# Altium schematic sheet Supplies.SchDoc
size 431 x 279 mm; Organization: ORGANIZATION; Address1: ADDRESS 1; Address2: ADDRESS 2; Address3: ADDRESS 3; Address4: ADDRESS 4; Revision: -; SheetNumber: 6; SheetTotal: 7; ENG_APP_DATE: --/--/--; DSN_APP_DATE: --/--/--; CHK_APP_DATE: --/--/--; SPICEModelCacheRLJPMQWR: <root> / <DocumentId>RLJPMQWR</DocumentId> / <CacheFrame Number="0"> / <Model Name="limit" Kind="CKT"> / <Text>*$ / .subckt limit d dc params: clampH=0.99 clampL=48m / Gd 0 dcx VALUE = { V(d)*100u } / Rdc dcx 0 10k / V1 clpn 0 {clampL} / V2 clpp 0 {clampH} / D1 clpn dcx dclamp / D2 dcx clpp dclamp / Edc dc 0 value={ V(dcx) } / .model dclamp d n=0.01 rs=100m / .ENDS</Text> / </Model> / <Model Name="limit2" Kind="CKT"> / <Text>*$ / .subckt limit2 d2nc d d2c / Gd 0 d2cx d2nc 0 100u / Rdc d2cx 0 10k / V1 clpn 0 7m / E2 clpp 0 Value = { 1-V(d) } / D1 clpn d2cx dclamp / D2 d2cx clpp dclamp / Edc d2c 0 value={ V(d2cx) } / .model dclamp d n=0.01 rs=100m / .ENDS</Text> / </Model> / <Model Name="varicap" Kind="CKT"> / <Text>*$ / .SUBCKT VARICAP 1 2 CTRL / GCAP 1 2 VALUE= {V(CTRL)*(DDT(V(1) - V(2)))} / .ENDS</Text> / </Model> / <Model Name="ccm3" Kind="CKT"> / <Text>*$ / .SUBCKT CCM3 a c p vc dc params: L=4.7u Fs=500k Ri=100m Acs=1 SE=0 / E_RI_mult RI_mult 0 Value = {ABS({-0.0895*V(a)+1.4416})} / E_se Se1 0 value = {ABS(I(VM))} / R111 se1 Se2 15.9 / C11 Se2 0 1u / E_SE_mult SE_mult 0 Value = {ABS({1.0526*V(SE2)+14.895})} / ESe Sa 0 value = { SE*FS*Ri*V(RI_mult)*V(SE_mult)} / Edc dcx 0 value = { v(cx,p)/(v(a,p)+1u) } / Xdc dcx dc limit params: clampH=0.99 clampL=48m / Ed2 d2X 0 value = {(1 - V(dc))} / Xd2 d2X dc d2 limit2 / GIap a p value =  {V(dc)*I(VM)} / GIpc p cx value = { V(vc)/({Acs}*{Ri*V(RI_mult) }) } / GImju cx p value = {V(Sa)*V(dc)/({Acs}*{Ri*V(RI_mult)}*{Fs})+(v(cx,p))/({L}*{Fs})*((1-(V(dc))/2)) } / XC1 cx p mode varicap / Emode mode 0 Value = { IF ((2*{L}*{Fs}*I(VM)/(V(dc)*V(a,cx)+1u)) / + &lt; 1, {4/({L}*(6.28*{Fs})^2)}, {4/({L}*(6.28*{Fs})^2)}) } / VM cx c / .ENDS CCM3</Text> / <Dependency>0\limit</Dependency> / <Dependency>0\limit2</Dependency> / <Dependency>0\varicap</Dependency> / </Model> / <Model Name="ccm2" Kind="CKT"> / <Text>*$ / .SUBCKT CCM2 a c p vc dc params: L=4.7u Fs=500k Ri=100m Acs=1 SE=0 / E_RI_mult RI_mult 0 Value = {ABS({-0.1*V(a)+1.35})} / E_se Se1 0 value = {ABS(I(VM))} / R111 se1 Se2 15.9 / C11 Se2 0 1u / E_SE_mult SE_mult 0 Value = {ABS({2.3492*V(SE2)+11.265})} / ESe Sa 0 value = { SE*FS*Ri*V(RI_mult)*V(SE_mult)} / Edc dcx 0 value = { v(cx,p)/(v(a,p)+1u) } / Xdc dcx dc limit params: clampH=0.99 clampL=48m / Ed2 d2X 0 value = {(1 - V(dc))} / Xd2 d2X dc d2 limit2 / GIap a p value =  {V(dc)*I(VM)} / GIpc p cx value = { V(vc)/({Acs}*{Ri*V(RI_mult) }) } / GImju cx p value = {V(Sa)*V(dc)/({Acs}*{Ri*V(RI_mult)}*{Fs})+(v(cx,p))/({L}*{Fs})*((1-(V(dc))/2)) } / XC1 cx p mode varicap / Emode mode 0 Value = { IF ((2*{L}*{Fs}*I(VM)/(V(dc)*V(a,cx)+1u)) / + &lt; 1, {4/({L}*(6.28*{Fs})^2)}, {4/({L}*(6.28*{Fs})^2)}) } / VM cx c / .ENDS CCM2</Text> / <Dependency>0\limit</Dependency> / <Dependency>0\limit2</Dependency> / <Dependency>0\varicap</Dependency> / </Model> / <Model Name="ccm1" Kind="CKT"> / <Text>*$ / .SUBCKT CCM1 a c p vc dc params: L=4.7u Fs=500k Ri=100m Acs=1 SE=0 / E_RI_mult RI_mult 0 Value = {ABS({-0.0411*V(a)+1.0268})} / E_se Se1 0 value = {ABS(I(VM))} / R111 se1 Se2 15.9 / C11 Se2 0 1u / E_SE_mult SE_mult 0 Value = {ABS({4.2153*V(SE2)+6.5785})} / ESe Sa 0 value = { SE*FS*Ri*V(RI_mult)*V(SE_mult)} / Edc dcx 0 value = { v(cx,p)/(v(a,p)+1u) } / Xdc dcx dc limit params: clampH=0.99 clampL=48m / Ed2 d2X 0 value = {(1 - V(dc))} / Xd2 d2X dc d2 limit2 / GIap a p value =  {V(dc)*I(VM)} / GIpc p cx value = { V(vc)/({Acs}*{Ri*V(RI_mult) }) } / GImju cx p value = {V(Sa)*V(dc)/({Acs}*{Ri*V(RI_mult)}*{Fs})+(v(cx,p))/({L}*{Fs})*((1-(V(dc))/2)) } / XC1 cx p mode varicap / Emode mode 0 Value = { IF ((2*{L}*{Fs}*I(VM)/(V(dc)*V(a,cx)+1u)) / + &lt; 1, {4/({L}*(6.28*{Fs})^2)}, {4/({L}*(6.28*{Fs})^2)}) } / VM cx c 0 / .ENDS CCM1</Text> / <Dependency>0\limit</Dependency> / <Dependency>0\limit2</Dependency> / <Dependency>0\varicap</Dependency> / </Model> / <Model Name="tps65266_avg" Kind="CKT"> / <Text>*$ / * TPS65266 / ***************************************************************************** / * (C) Copyright 2014 Texas Instruments Incorporated. All rights reserved. / ***************************************************************************** / ** This model is designed as an aid for customers of Texas Instruments. / ** TI and its licensors and suppliers make no warranties, either expressed / ** or implied, with respect to this model, including the warranties of / ** merchantability or fitness for a particular purpose.  The model is / ** provided solely on an "as is" basis.  The entire risk as to its quality / ** and performance is with the customer / ***************************************************************************** / * / * This model is subject to change without notice. Texas Instruments / * Incorporated is not responsible for updating this model. / * / ***************************************************************************** / * / ** Released by: WEBENCH Design Center, Texas Instruments Inc. / * Part: TPS65266 / * Date: 25NOV2014 / * Model Type: AVERAGE / * Simulator: PSPICE / * Simulator Version: 16.2.0.p001 / * EVM Order Number: TPS65266EVM-686 / * EVM Users Guide: NA / * Datasheet: NA / * / * Model Version: Final 1.00 / * / ***************************************************************************** / * / * Updates: / * / * Final 1.00 / * Release to Web. / * / ***************************************************************************** / .SUBCKT TPS65266_AVG COMP1 COMP2 COMP3 FB1 FB2 FB3 LX1 LX2 LX3 VIN1 VIN2 VIN3 / + VINQ EN1 EN2 EN3 SS1 SS2 SS3 ROSC BST1 BST2 BST3 PGOOD AGND_0 AGND_1 AGND_2 AGND_3 AGND_4 / + PGND1 PGND2 PGND3 PAD PARAMS: L1=2.2u L2=2.2u L3=2.2u FS1=1000k FS2=1000k FS3=1000k / RVINQ1 VINQ PGND1 1e8 / RVINQ2 VINQ PGND1 1e8 / REN1 EN1 PGND1 1e8 / REN2 EN1 PGND1 1e8 / REN3 EN2 PGND1 1e8 / REN4 EN2 PGND1 1e8 / REN5 EN3 PGND1 1e8 / REN6 EN3 PGND1 1e8 / RSS1 SS1 PGND1 1e8 / RSS2 SS1 PGND1 1e8 / RSS3 SS2 PGND1 1e8 / RSS4 SS2 PGND1 1e8 / RSS5 SS3 PGND1 1e8 / RSS6 SS3 PGND1 1e8 / R_ROSC1 ROSC PGND1 1e8 / R_ROSC2 ROSC PGND1 1e8 / RBST1 BST1 PGND1 1e8 / RBST2 BST1 PGND1 1e8 / RBST3 BST2 PGND1 1e8 / RBST4 BST2 PGND1 1e8 / RBST5 BST3 PGND1 1e8 / RBST6 BST3 PGND1 1e8 / R_PGOOD1 PGOOD PGND1 1e8 / R_PGOOD2 PGOOD PGND1 1e8 / R1 0 AGND_0 1u / R2 0 AGND_1 1u / R3 0 AGND_2 1u / R4 0 AGND_3 1u / R5 0 AGND_4 1u / R5x AGND_4 0 1u / R6 0 PGND_2 1u / R61 0 PGND_2 1u / R7 0 PGND_3 1u / R71 0 PGND_3 1u / RPAD1 PAD 0 1e8 / RPAD2 PAD 0 1e8 / G_U2_ABM2I1         COMP2 0 VALUE { (V(FB2) - V(VREF_INT))* / + {0.1658*I(V_U2_V1)+0.6284}*300u    } / V_U2_V1         U2_N14535319 LX2 0Vdc / R_U2_R19         0 COMP2  13.3e6 / X_U2_U5         VIN2 U2_N14535319 0 COMP2 U2_DC CCM2 PARAMS:  L={L2} FS={FS2} / +  RI={100m} SE={275k/FS2} ACS=1 / X_U3_U5         VIN3 U3_N14535845 0 COMP3 U3_DC CCM3 PARAMS:  L={L3} FS={FS3} / +  RI={100m} SE={275k/FS3} ACS=1 / G_U3_ABM2I1         COMP3 0 VALUE { (V(FB3) - V(VREF_INT))* / + {0.0526*I(V_U3_V1)+0.8947}*300u    } / V_U3_V1         U3_N14535845 LX3 0Vdc / R_U3_R19         0 COMP3  13.3e6 / R_R1         0 PGND1  1m / V_V29         VREF_INT PGND1 0.6 / G_U1_ABM2I1         COMP1 0 VALUE { (V(FB1) - V(VREF_INT))* / + {0.0983*I(V_U1_V1)+0.7052}*300u    } / R_U1_R19         0 COMP1  13.3e6 / V_U1_V1         U1_N14534791 LX1 0Vdc / X_U1_U5         VIN1 U1_N14534791 0 COMP1 U1_DC CCM1 PARAMS:  L={L1} FS={FS1} / +  RI={100m} SE={275k/FS1} ACS=1 / .ENDS TPS65266_AVG</Text> / <Dependency>0\ccm3</Dependency> / <Dependency>0\ccm2</Dependency> / <Dependency>0\ccm1</Dependency> / </Model> / <Model Name="grm21br61a226me44" Kind="CKT"> / <Text>*---------------------------------------------------------------------- / * SPICE Model generated by Murata Manufacturing Co., Ltd. / * Copyright(C) Murata Manufacturing Co., Ltd. / * Description :2012M(0805)/X5R/22uF/10V / * Murata P/N :GRM21BR61A226ME44 / * Property : C = 22[uF] / * Data Generated on Jan 8, 2019 / *---------------------------------------------------------------------- / * Applicable Conditions: / *   Frequency Range = 100Hz-6GHz / *   Temperature = 25 degC / *   DC Bias Voltage = 0V / *   Small Signal Operation / *---------------------------------------------------------------------- / .SUBCKT GRM21BR61A226ME44 port1 port2 / C1 port1 11 1.70e-5 / L2 11 12 1.60e-10 / R3 12 13 2.11e-3 / C4 13 14 6.67e-4 / R4 13 14 7.95 / C5 14 15 7.65e-4 / R5 14 15 7.74e-1 / C6 15 16 7.03e-4 / R6 15 16 9.99e-2 / C7 16 17 6.45e-4 / R7 16 17 1.24e-2 / C8 17 18 6.19e-4 / R8 17 18 1.97e-3 / L9 18 19 1.62e-11 / R9 18 19 5.44e-2 / L10 19 20 3.66e-11 / R10 19 20 2.02e-2 / L11 20 21 3.37e-10 / R11 20 21 1.34e-2 / C12 21 22 5.83e-5 / L12 21 22 6.41e-11 / R12 21 22 3.35e-3 / C13 22 23 2.26e-5 / L13 22 23 8.31e-11 / R13 22 23 3.61e-3 / C14 23 port2 4.77e-12 / L14 23 port2 8.46e-11 / R14 23 port2 14.7 / R100 port1 11 2.27e+6 / .ENDS GRM21BR61A226ME44</Text> / </Model> / <Model Name="grm033r71c472ke14" Kind="CKT"> / <Text>*---------------------------------------------------------------------- / * SPICE Model generated by Murata Manufacturing Co., Ltd. / * Copyright(C) Murata Manufacturing Co., Ltd. / * Description :0603M(0201)/X7R/4700pF/16V / * Murata P/N :GRM033R71C472KE14 / * Property : C = 4700[pF] / * Data Generated on Nov 6, 2018 / *---------------------------------------------------------------------- / * Applicable Conditions: / *   Frequency Range = 100Hz-6GHz / *   Temperature = 25 degC / *   DC Bias Voltage = 0V / *   Small Signal Operation / *---------------------------------------------------------------------- / .SUBCKT GRM033R71C472KE14 port1 port2 / C1 port1 11 4.78e-9 / L2 11 12 2.10e-10 / R3 12 13 1.03e-1 / C4 13 14 4.70e-7 / R4 13 14 2.85e+3 / C5 14 15 5.61e-7 / R5 14 15 272 / C6 15 16 5.58e-7 / R6 15 16 23.7 / C7 16 17 3.68e-7 / R7 16 17 3.60 / C8 17 18 2.23e-7 / R8 17 18 6.17e-1 / C9 18 19 2.36e-7 / R9 18 19 9.83e-2 / L10 19 20 4.26e-11 / R10 19 20 2.65e-1 / C11 20 21 8.59e-9 / L11 20 21 9.53e-12 / R11 20 21 4.47e-2 / C12 21 port2 9.05e-12 / L12 21 port2 2.55e-11 / R12 21 port2 2.08 / R100 port1 11 2.00e+9 / .ENDS GRM033R71C472KE14</Text> / </Model> / <Model Name="mapi_4020_74438356022_2u2" Kind="CKT"> / <Text>******* / .subckt MAPI_4020_74438356022_2u2 1 2 / Rp 1 2 4123.86235634 / Cp 1 2 9.7152950084p / Rs 1 N3 0.029 / L1 N3 2 2.18u / .ends MAPI_4020_74438356022_2u2</Text> / </Model> / <Model Name="mapi_4020_74438356047_4u7" Kind="CKT"> / <Text>******* / .subckt MAPI_4020_74438356047_4u7 1 2 / Rp 1 2 7737.2732555125 / Cp 1 2 11.1535766864p / Rs 1 N3 0.063 / L1 N3 2 4.67u / .ends MAPI_4020_74438356047_4u7</Text> / </Model> / <Model Name="c0402c102j5gacauto" Kind="CKT"> / <Text>.SUBCKT C0402C102J5GACAUTO 1 6 / *Temp = 25??C, Bias = 0VDC, Center Frequency = 10000 Hz / *KEMET Model RLC Cerm / R1 3 4 1.21294260025024 / R2 2 5 0.910000026226044 / R3 1 6 99999997952 / L1 1 2 1.36999994682085E-11 / L2 2 3 2.60299989895962E-10 / C1 4 6 9.99999971718069E-10 / C2 5 6 5.99999986588955E-14 / .ENDS</Text> / </Model> / <Model Name="grm155r71h103ka88" Kind="CKT"> / <Text>*---------------------------------------------------------------------- / * SPICE Model generated by Murata Manufacturing Co., Ltd. / * Copyright(C) Murata Manufacturing Co., Ltd. / * Description :1005M(0402)/X7R/10000pF/50V / * Murata P/N :GRM155R71H103KA88 / * Property : C = 10000[pF] / * Data Generated on Jan 10, 2017 / *---------------------------------------------------------------------- / * Applicable Conditions: / *   Frequency Range = 100kHz-6GHz / *   Temperature = 25 degC / *   DC Bias Voltage = 0V / *   Small Signal Operation / *---------------------------------------------------------------------- / .SUBCKT GRM155R71H103KA88 port1 port2 / C1 port1 11 9.66e-9 / L2 11 12 1.81e-10 / R3 12 13 4.87e-2 / C4 13 14 8.69e-7 / R4 13 14 1.77 / C5 14 15 7.39e-7 / R5 14 15 3.60e-1 / C6 15 16 9.13e-7 / R6 15 16 6.29e-2 / C7 16 17 5.45e-7 / R7 16 17 2.36e-2 / L8 17 18 5.77e-11 / R8 17 18 2.28e-1 / C9 18 19 1.55e-7 / L9 18 19 4.43e-12 / R9 18 19 1.53e-2 / C10 19 20 9.52e-9 / L10 19 20 3.19e-11 / R10 19 20 7.37e-2 / C11 20 port2 4.31e-12 / L11 20 port2 6.52e-11 / R11 20 port2 11.1 / R100 port1 11 1.00e+10 / .ENDS GRM155R71H103KA88</Text> / </Model> / <Model Name="grm155r61c225ke11" Kind="CKT"> / <Text>*---------------------------------------------------------------------- / * SPICE Model generated by Murata Manufacturing Co., Ltd. / * Copyright(C) Murata Manufacturing Co., Ltd. / * Description :1005M(0402)/X5R/2.2uF/16V / * Murata P/N :GRM155R61C225KE11 / * Property : C = 2.2[uF] / * Data Generated on Oct 1, 2019 / *---------------------------------------------------------------------- / * Applicable Conditions: / *   Frequency Range = 100Hz-6GHz / *   Temperature = 25 degC / *   DC Bias Voltage = 0V / *   Small Signal Operation / *---------------------------------------------------------------------- / .SUBCKT GRM155R61C225KE11 port1 port2 / C1 port1 11 1.73e-6 / L2 11 12 1.79e-10 / R3 12 13 6.35e-3 / C4 13 14 6.00e-5 / R4 13 14 85.7 / C5 14 15 9.14e-5 / R5 14 15 5.82 / C6 15 16 8.03e-5 / R6 15 16 9.40e-1 / C7 16 17 7.76e-5 / R7 16 17 1.47e-1 / C8 17 18 7.79e-5 / R8 17 18 2.69e-2 / C9 18 19 4.69e-5 / R9 18 19 8.75e-3 / L10 19 20 1.90e-11 / R10 19 20 2.12e-1 / L11 20 21 3.14e-11 / R11 20 21 6.04e-2 / L12 21 22 1.38e-10 / R12 21 22 2.71e-2 / C13 22 23 6.24e-6 / L13 22 23 3.27e-11 / R13 22 23 4.67e-3 / C14 23 24 2.47e-6 / L14 23 24 3.93e-11 / R14 23 24 6.91e-3 / C15 24 port2 4.51e-11 / L15 24 port2 8.52e-12 / R15 24 port2 9.19e-1 / R100 port1 11 2.27e+7 / .ENDS GRM155R61C225KE11</Text> / </Model> / </CacheFrame> / </root>
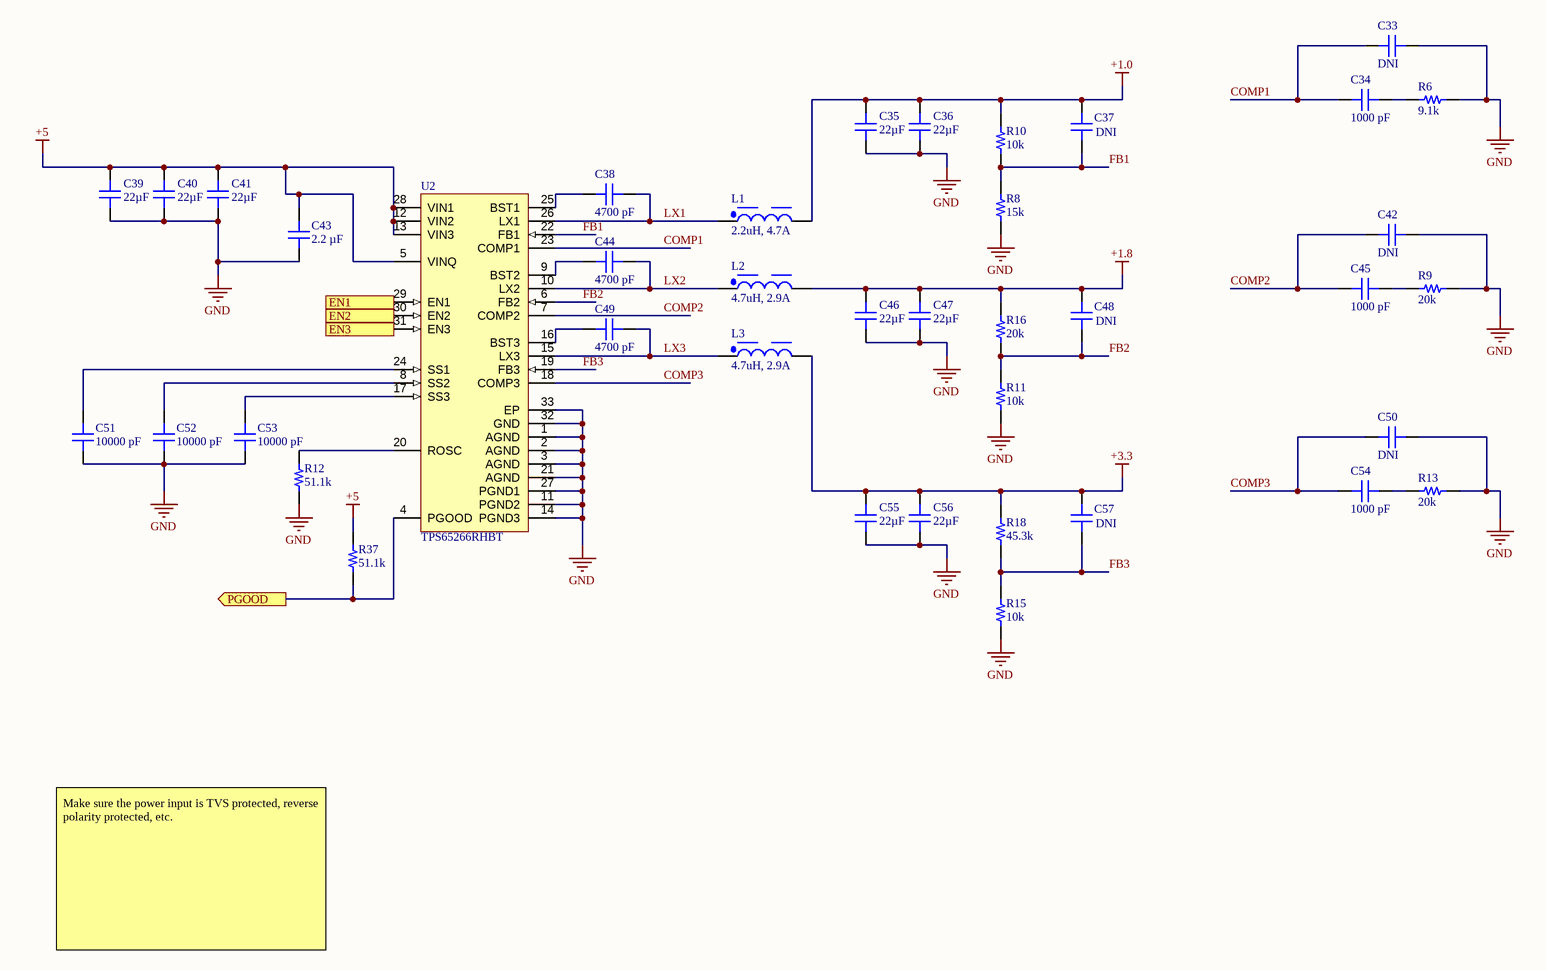
[diagram p0: Supplies.SchDoc]

## Parts
C33  DNI  [CAP 0402_1005]  (no BOM)
C34  1000 pF  [CAP 0402_1005]
C35  22µF  [CAP 0805_2012]
C36  22µF  [CAP 0805_2012]
C37  DNI  [CAP 0402_1005]  (no BOM)
C38  4700 pF  [CAP 0201_0603]
C39  22µF  [CAP 0805_2012]
C40  22µF  [CAP 0805_2012]
C41  22µF  [CAP 0805_2012]
C42  DNI  [CAP 0402_1005]  (no BOM)
C43  2.2 µF  [CAP 0402_1005]
C44  4700 pF  [CAP 0201_0603]
C45  1000 pF  [CAP 0402_1005]
C46  22µF  [CAP 0805_2012]
C47  22µF  [CAP 0805_2012]
C48  DNI  [CAP 0402_1005]  (no BOM)
C49  4700 pF  [CAP 0201_0603]
C50  DNI  [CAP 0402_1005]  (no BOM)
C51  10000 pF  [CAP 0402_1005]
C52  10000 pF  [CAP 0402_1005]
C53  10000 pF  [CAP 0402_1005]
C54  1000 pF  [CAP 0402_1005]
C55  22µF  [CAP 0805_2012]
C56  22µF  [CAP 0805_2012]
C57  DNI  [CAP 0402_1005]  (no BOM)
L1  2.2uH, 4.7A  [WE-MAPI_4020]
L2  4.7uH, 2.9A  [WE-MAPI_4020]
L3  4.7uH, 2.9A  [WE-MAPI_4020]
R6  9.1k  [RES 0402_1005]
R8  15k  [RES 0402_1005]
R9  20k  [RES 0402_1005]
R10  10k  [RES 0402_1005]
R11  10k  [RES 0402_1005]
R12  51.1k  [RES 0402_1005]
R13  20k  [RES 0402_1005]
R15  10k  [RES 0402_1005]
R16  20k  [RES 0402_1005]
R18  45.3k  [RES 0402_1005]
R37  51.1k  [RES 0402_1005]
U2  TPS65266RHBT  [RHB0032E_V]

## Ports
EN1 (in), EN2 (in), EN3 (in), PGOOD (out)

## Nets
+1.0: C35.1 C36.1 C37.2 L1.2 R10.2
+1.8: C46.1 C47.1 C48.2 L2.2 R16.2
+3.3: C55.1 C56.1 C57.2 L3.2 R18.2
+5: C39.1 C40.1 C41.1 C43.2 R37.2 U2.5(VINQ) U2.12(VIN2) U2.13(VIN3) U2.28(VIN1)
GND: C33.1 C35.2 C36.2 C39.2 C40.2 C41.2 C42.1 C43.1 C46.2 C47.2 C50.1 C51.1 C52.1 C53.1 C55.2 C56.2 R6.2 R8.1 R9.2 R11.1 R12.1 R13.1 R15.1 U2.1(AGND) U2.2(AGND) U2.3(AGND) U2.11(PGND2) U2.14(PGND3) U2.21(AGND) U2.27(PGND1) U2.32(GND) U2.33(EP)
COMP1: C33.2 C34.2 U2.23(COMP1)
COMP2: C42.2 C45.2 U2.7(COMP2)
COMP3: C50.2 C54.2 U2.18(COMP3)
EN1: U2.29(EN1) ; port EN1
EN2: U2.30(EN2) ; port EN2
EN3: U2.31(EN3) ; port EN3
FB1: C37.1 R8.2 R10.1 U2.22(FB1)
FB2: C48.1 R11.2 R16.1 U2.6(FB2)
FB3: C57.1 R15.2 R18.1 U2.19(FB3)
LX1: C38.2 L1.1 U2.26(LX1)
LX2: C44.2 L2.1 U2.10(LX2)
LX3: C49.2 L3.1 U2.15(LX3)
PGOOD: R37.1 U2.4(PGOOD) ; port PGOOD
NetC34_1: C34.1 R6.1
NetC38_1: C38.1 U2.25(BST1)
NetC44_1: C44.1 U2.9(BST2)
NetC45_1: C45.1 R9.1
NetC49_1: C49.1 U2.16(BST3)
NetC51_2: C51.2 U2.24(SS1)
NetC52_2: C52.2 U2.8(SS2)
NetC53_2: C53.2 U2.17(SS3)
NetC54_1: C54.1 R13.2
NetR12_2: R12.2 U2.20(ROSC)

## Notes on the sheet
- Make sure the power input is TVS protected, reverse polarity protected, etc.
- DWG. NO.
- REV.
- SHT.
- REVISION
- DESCRIPTION
- DATE
- APPROVED
- ENG:
- APPROVALS
- PROJECT
- DSN:
- CHK:
- REFERENCE DOCUMENTS
- PROJECT REVISION:
- TITLE
- SimulaVR
- DOCUMENT REVISION:
- DESIGN ITEM:
- BOM:
- FAB DWG:
- PCB DWG:
- ASSY DWG:
- SCALE:
- SIZE
- B
- CAGE CODE
- FILE NAME
- DWG NO.
- SHEET
- OF
- REV

## Library data of the parts
C33 C37 C42 C48 C50 C57 = 885012205048: Device Package: 0402 (1005 Metric); Package / Case: 0402 (1005 Metric)
C34 C45 C54 = C0402C102J5GACAUTO: CAP CER 1000PF 50V C0G/NP0 0402; manufacturer: KEMET; Temperature Coefficient: C0G, NP0; Tolerance: ±5%; Part Number: C0402C102J5GACAUTO; Value: 1000 pF; Applications: Automotive; Capacitance: 1000 pF; componentlink1description: Datasheet; componentlink1url: https://api.kemet.com/component-edge/download/datasheet/C0402C102J5GACAUTO.pdf; componentlink2description: DigiKey Link; componentlink2url: https://www.digikey.com/en/products/detail/kemet/C0402C102J5GACAUTO/5762248; Device Package: 0402 (1005 Metric); Features: Low ESL; lastupdated: 2022-04-02 05:51:59; Lifecycle Status: Active; Minimum Order: 1; Mounting Type: Surface Mount, MLCC; Operating Temperature: -55°C ~ 125°C; Package / Case: 0402 (1005 Metric); packaging: TapeAndReel; partid: 2092; Part Status: Active; price: 0.01; Ratings: AEC-Q200; series: SMD Auto C0G; Size / Dimension: 0.039" L x 0.020" W (1.00mm x 0.50mm); Supplier 1: DigiKey; Supplier Part Number 1: 399-12992-1-ND; Thickness (Max): 0.022" (0.55mm); Voltage - Rated: 50V
C35 C36 C39-C41 C46 C47 C55 C56 = GRM21BR61A226ME44L: CAP CER 22UF 10V X5R 0805; Manufacturer: Murata Electronics; Tolerance: ±20%; Part Number: GRM21BR61A226ME44L; Value: 22µF; Capacitance: 22µF; ComponentLink1Description: Datasheet; ComponentLink1URL: https://search.murata.co.jp/Ceramy/image/img/A01X/G101/ENG/GRM21BR61A226ME44-01.pdf; ComponentLink2Description: DigiKey Link; ComponentLink2URL: http://digikey.com/product-detail/en/murata-electronics/GRM21BR61A226ME44L/490-10746-1-ND/5251354; Device Package: 0805 (2012 Metric); LastUpdated: 9/2/2020 1:04:36 AM; Lifecycle Status: Active; Minimum Order: 1; Mounting Type: Surface Mount, MLCC; Operating Temperature: -55°C ~ 85°C; Package / Case: 0805 (2012 Metric); Packaging: TapeAndReel; PartId: 6027; Part Status: Active; Price: 0.12; Series: GRM; Size / Dimension: 0.079" L x 0.049" W (2.00mm x 1.25mm); Supplier 1: DigiKey; Supplier Part Number 1: 490-10746-1-ND; Voltage - Rated: 10V; Applications: General Purpose; Temperature Coefficient: X5R; Thickness (Max): 0.057" (1.45mm)
C38 C44 C49 = GRM033R71C472KE14D: CAP CER 4700PF 16V X7R 0201; manufacturer: Murata Electronics; Tolerance: ±10%; Part Number: GRM033R71C472KE14D; Value: 4700 pF; Applications: General Purpose; Capacitance: 4700 pF; componentlink1description: Datasheet; componentlink1url: https://search.murata.co.jp/Ceramy/image/img/A01X/G101/ENG/GRM033R71C472KE14-01.pdf; componentlink2description: DigiKey Link; componentlink2url: https://www.digikey.com/en/products/detail/murata-electronics/GRM033R71C472KE14D/9759065; Device Package: 0201 (0603 Metric); lastupdated: 3/31/2022 8:40:13 AM; Lifecycle Status: Active; Minimum Order: 1; Mounting Type: Surface Mount, MLCC; Operating Temperature: -55°C ~ 125°C; Package / Case: 0201 (0603 Metric); packaging: CutTape; partid: 1416; Part Status: Active; price: 0.01; series: GRM; Size / Dimension: 0.024" L x 0.012" W (0.60mm x 0.30mm); Supplier 1: DigiKey; Supplier Part Number 1: 490-17113-1-ND; Temperature Coefficient: X7R; Thickness (Max): 0.013" (0.33mm); Voltage - Rated: 16V
C43 = GRM155R61C225KE11D: CAP CER 2.2UF 16V X5R 0402; manufacturer: Murata Electronics; Tolerance: ±10%; Part Number: GRM155R61C225KE11D; Value: 2.2 µF; Applications: General Purpose; Capacitance: 2.2 µF; componentlink1description: Datasheet; componentlink1url: https://search.murata.co.jp/Ceramy/image/img/A01X/G101/ENG/GRM155R61C225KE11-01.pdf; componentlink2description: DigiKey Link; componentlink2url: https://www.digikey.com/en/products/detail/murata-electronics/GRM155R61C225KE11D/4905134; Device Package: 0402 (1005 Metric); lastupdated: 2022-04-02 05:51:52; Lifecycle Status: Active; Minimum Order: 1; Mounting Type: Surface Mount, MLCC; Operating Temperature: -55°C ~ 85°C; Package / Case: 0402 (1005 Metric); packaging: TapeAndReel; partid: 4130; Part Status: Active; price: 0.03; series: GRM; Size / Dimension: 0.039" L x 0.020" W (1.00mm x 0.50mm); Supplier 1: DigiKey; Supplier Part Number 1: 490-10695-1-ND; Temperature Coefficient: X5R; Thickness (Max): 0.022" (0.55mm); Voltage - Rated: 16V
C51-C53 = GRM155R71H103KA88D: CAP CER 10000PF 50V X7R 0402; manufacturer: Murata Electronics; Tolerance: ±10%; Part Number: GRM155R71H103KA88D; Value: 10000 pF; Applications: General Purpose; Capacitance: 10000 pF; componentlink1description: Datasheet; componentlink1url: https://www.murata.com/~/media/webrenewal/support/library/catalog/products/capacitor/mlcc/c02e.ashx?la=en-us; componentlink2description: DigiKey Link; componentlink2url: https://www.digikey.com/en/products/detail/murata-electronics/GRM155R71H103KA88D/1033252; Device Package: 0402 (1005 Metric); lastupdated: 2022-04-02 05:51:24; Lifecycle Status: Active; Minimum Order: 1; Mounting Type: Surface Mount, MLCC; Operating Temperature: -55°C ~ 125°C; Package / Case: 0402 (1005 Metric); packaging: TapeAndReel; partid: 12559; Part Status: Active; price: 0.01; series: GRM; Size / Dimension: 0.039" L x 0.020" W (1.00mm x 0.50mm); Supplier 1: DigiKey; Supplier Part Number 1: 490-4516-1-ND; Temperature Coefficient: X7R; Thickness (Max): 0.022" (0.55mm); Voltage - Rated: 50V
L1 = 74438356022: WE-MAPI SMT Power Inductor, size 4020, 2.2uH, 4.7A; Manufacturer: Wurth Elektronik; DC Resistance typ.: 29mOhm; DC Resistance max.: 35mOhm; Self Resonant Frequency: 34MHz; Saturation Current: 6.2A; ComponentLink1Description: Manufacturer; ComponentLink1URL: http://www.we-online.de; ComponentLink2Description: Datasheet; ComponentLink2URL: https://www.we-online.com/catalog/datasheet/74438356022.pdf; Mounting Technology: SMT; Operating Temperature: -40 to +125degC; Packaging: Tape and Reel; Size: 4020; Inductance: 2.2uH; Manufacturer Part Number: 74438356022; Rated Current: 4.7A; Height: 2.1mm; Length: 4.1mm; Width: 4.1mm; Value: 2.2uH
L2 L3 = 74438356047: WE-MAPI SMT Power Inductor, size 4020, 4.7uH, 2.9A; Manufacturer: Wurth Elektronik; DC Resistance typ.: 63mOhm; DC Resistance max.: 76mOhm; Self Resonant Frequency: 22MHz; Saturation Current: 4.7A; ComponentLink1Description: Manufacturer; ComponentLink1URL: http://www.we-online.de; ComponentLink2Description: Datasheet; ComponentLink2URL: https://www.we-online.com/catalog/datasheet/74438356047.pdf; Mounting Technology: SMT; Operating Temperature: -40 to +125degC; Packaging: Tape and Reel; Size: 4020; Inductance: 4.7uH; Manufacturer Part Number: 74438356047; Rated Current: 2.9A; Height: 2.1mm; Length: 4.1mm; Width: 4.1mm; Value: 4.7uH
R6 = ERJ-2RKF9101X: RES SMD 9.1K OHM 1% 1/10W 0402; Manufacturer: Panasonic Electronic Components; Power (Watts): 0.1W, 1/10W; Resistance: 9.1 kOhms; Temperature Coefficient: ±100ppm/°C; Part Number: ERJ-2RKF9101X; Value: 9.1k; ComponentLink1Description: Datasheet; ComponentLink1URL: https://industrial.panasonic.com/cdbs/www-data/pdf/RDA0000/AOA0000C304.pdf; ComponentLink2Description: DigiKey Link; ComponentLink2URL: https://www.digikey.com/en/products/detail/panasonic-electronic-components/ERJ-2RKF9101X/1746291; Composition: Thick Film; Device Package: 0402 (1005 Metric); Features: Automotive AEC-Q200; Height - Seated (Max): 0.016" (0.40mm); LastUpdated: 2022-04-02 06:08:06; Lifecycle Status: Active; Minimum Order: 1; Number of Terminations: 2; Operating Temperature: -55°C ~ 155°C; Package / Case: 0402 (1005 Metric); Packaging: CutTape; PartId: 3868; Part Status: Active; Price: 0.01; Ratings: AEC-Q200; Series: ERJ-2RK; Size / Dimension: 0.039" L x 0.020" W (1.00mm x 0.50mm); Supplier 1: DigiKey; Supplier Part Number 1: P9.10KLCT-ND; Supplier Device Package: 0402; Tolerance: ±1%
R8 = ERA-2AED153X: RES SMD 15K OHM 0.5% 1/16W 0402; Manufacturer: Panasonic Electronic Components; Power (Watts): 0.063W, 1/16W; Resistance: 15 kOhms; Temperature Coefficient: ±25ppm/°C; Part Number: ERA-2AED153X; Value: 15k; ComponentLink1Description: Datasheet; ComponentLink1URL: https://industrial.panasonic.com/cdbs/www-data/pdf/RDM0000/AOA0000C307.pdf; ComponentLink2Description: DigiKey Link; ComponentLink2URL: http://digikey.com/product-detail/en/panasonic-electronic-components/ERA-2AED153X/P15KDECT-ND/1706308; Composition: Thin Film; Device Package: 0402 (1005 Metric); Features: Automotive AEC-Q200; Height - Seated (Max): 0.016" (0.40mm); LastUpdated: 2022-04-02 06:07:29; Lifecycle Status: Active; Minimum Order: 1; Number of Terminations: 2; Operating Temperature: -55°C ~ 155°C; Package / Case: 0402 (1005 Metric); Packaging: TapeAndReel; PartId: 14044; Part Status: Active; Price: 0.02; Ratings: AEC-Q200; Series: ERA-2A; Size / Dimension: 0.039" L x 0.020" W (1.00mm x 0.50mm); Supplier 1: DigiKey; Supplier Part Number 1: P15KDECT-ND; Supplier Device Package: 0402; Tolerance: ±0.5%
R9 R13 R16 = ERA-2AED203X: RES SMD 20K OHM 0.5% 1/16W 0402; Manufacturer: Panasonic Electronic Components; Power (Watts): 0.063W, 1/16W; Resistance: 20 kOhms; Temperature Coefficient: ±25ppm/°C; Part Number: ERA-2AED203X; Value: 20k; ComponentLink1Description: Datasheet; ComponentLink1URL: https://industrial.panasonic.com/cdbs/www-data/pdf/RDM0000/AOA0000C307.pdf; ComponentLink2Description: DigiKey Link; ComponentLink2URL: https://www.digikey.com/en/products/detail/panasonic-electronic-components/ERA-2AED203X/1706133; Composition: Thin Film; Device Package: 0402 (1005 Metric); Features: Automotive AEC-Q200; Height - Seated (Max): 0.016" (0.40mm); LastUpdated: 2022-04-02 06:07:29; Lifecycle Status: Active; Minimum Order: 1; Number of Terminations: 2; Operating Temperature: -55°C ~ 155°C; Package / Case: 0402 (1005 Metric); Packaging: TapeAndReel; PartId: 14046; Part Status: Active; Price: 0.02; Ratings: AEC-Q200; Series: ERA-2A; Size / Dimension: 0.039" L x 0.020" W (1.00mm x 0.50mm); Supplier 1: DigiKey; Supplier Part Number 1: P20KDECT-ND; Supplier Device Package: 0402; Tolerance: ±0.5%
R10 R11 R15 = ERA-2AED103X: RES SMD 10K OHM 0.5% 1/16W 0402; Manufacturer: Panasonic Electronic Components; Power (Watts): 0.063W, 1/16W; Resistance: 10 kOhms; Temperature Coefficient: ±25ppm/°C; Part Number: ERA-2AED103X; Value: 10k; ComponentLink1Description: Datasheet; ComponentLink1URL: https://industrial.panasonic.com/cdbs/www-data/pdf/RDM0000/AOA0000C307.pdf; ComponentLink2Description: DigiKey Link; ComponentLink2URL: http://digikey.com/product-detail/en/panasonic-electronic-components/ERA-2AED103X/P10KDECT-ND/1706304; Composition: Thin Film; Device Package: 0402 (1005 Metric); Features: Automotive AEC-Q200; Height - Seated (Max): 0.016" (0.40mm); LastUpdated: 2022-04-02 06:08:09; Lifecycle Status: Active; Minimum Order: 1; Number of Terminations: 2; Operating Temperature: -55°C ~ 155°C; Package / Case: 0402 (1005 Metric); Packaging: TapeAndReel; PartId: 3134; Part Status: Active; Price: 0.02; Ratings: AEC-Q200; Series: ERA-2A; Size / Dimension: 0.039" L x 0.020" W (1.00mm x 0.50mm); Supplier 1: DigiKey; Supplier Part Number 1: P10KDECT-ND; Supplier Device Package: 0402; Tolerance: ±0.5%
R12 R37 = RK73H1ETTP5112F: RES 51.1K OHM 1% 1/10W 0402; Manufacturer: KOA Speer Electronics, Inc.; Power (Watts): 0.1W, 1/10W; Resistance: 51.1 kOhms; Temperature Coefficient: ±100ppm/°C; Part Number: RK73H1ETTP5112F; Value: 51.1k; ComponentLink1Description: Datasheet; ComponentLink1URL: http://www.koaspeer.com/catimages/Products/RK73H/RK73H.pdf; ComponentLink2Description: DigiKey Link; ComponentLink2URL: http://digikey.com/product-detail/en/koa-speer-electronics-inc/RK73H1ETTP5112F/2019-RK73H1ETTP5112FCT-ND/9846174; Composition: Thick Film; Device Package: 0402 (1005 Metric); Features: Automotive AEC-Q200, Moisture Resistant; Height - Seated (Max): 0.016" (0.40mm); LastUpdated: 2022-04-02 06:07:43; Lifecycle Status: Active; Minimum Order: 1; Number of Terminations: 2; Operating Temperature: -55°C ~ 155°C; Package / Case: 0402 (1005 Metric); Packaging: CutTape; PartId: 10063; Part Status: Active; Price: 0.10; Ratings: AEC-Q200; Series: RK73H; Size / Dimension: 0.039" L x 0.020" W (1.00mm x 0.50mm); Supplier 1: DigiKey; Supplier Part Number 1: 2019-RK73H1ETTP5112FCT-ND; Supplier Device Package: 0402; Tolerance: ±1%
R18 = RNCF0402DTE45K3: RES 45.3K OHM 0.5% 1/16W 0402; Manufacturer: Stackpole Electronics Inc; Power (Watts): 0.063W, 1/16W; Resistance: 45.3 kOhms; Temperature Coefficient: ±25ppm/°C; Part Number: RNCF0402DTE45K3; Value: 45.3k; ComponentLink1Description: Datasheet; ComponentLink1URL: https://www.seielect.com/catalog/sei-rncf.pdf; ComponentLink2Description: DigiKey Link; ComponentLink2URL: https://www.digikey.com/en/products/detail/stackpole-electronics-inc/RNCF0402DTE45K3/6260724; Composition: Thin Film; Device Package: 0402 (1005 Metric); Features: Automotive AEC-Q200; Height - Seated (Max): 0.014" (0.35mm); LastUpdated: 2022-04-02 06:07:41; Lifecycle Status: Active; Minimum Order: 1; Number of Terminations: 2; Operating Temperature: -55°C ~ 155°C; Package / Case: 0402 (1005 Metric); Packaging: TapeAndReel; PartId: 10862; Part Status: Active; Price: 0.02; Ratings: AEC-Q200; Series: RNCF; Size / Dimension: 0.039" L x 0.020" W (1.00mm x 0.50mm); Supplier 1: DigiKey; Supplier Part Number 1: RNCF0402DTE45K3CT-ND; Supplier Device Package: 0402; Tolerance: ±0.5%
U2 = CMP-2000-07283-1: 3 A/2 A/2 A Output Current Synchronous Buck Converter, 2.7 to 6.5 V, -40 to 85 degC, 32-Pin VQFN (RHB), Green (RoHS & no Sb/Br), Tape and Reel; Manufacturer: TexasInstruments; Input Voltage MIN: 2.7V; Output Voltage: Adjustable; Output Current: 2A,3A; Switching Frequency: 1MHz; Input Voltage MAX: 6.5V; Input Voltage: 2.7Vto6.5V; Unit Weight: 0.002547oz; Mounting Style: SMD/SMT; Datasheet URL: http://www.ti.com/lit/ds/symlink/tps65266.pdf; Operating Temperature Range: -40Cto+85C; Datasheet Version: Rev. B, 01/2015; Series: TPS65266; Manufacturer URL: http://www.ti.com/; Topology: Buck; Maximum Operating Temperature: +85C; Package / Case: VQFN-32; Factory Pack Quantity: 250; Packaging: Reel; Product Category: VoltageRegulators-SwitchingRegulators; Shutdown: Shutdown; Package Reference: RHB0032E; Mounting Technology: SurfaceMount; Package Description: 32-Pin Plastic Quad Flat No-lead Package, Body 5 x 5 mm, Pitch 0.5 mm, Thermal Pad 3.45 x 3.45 mm; Brand: TexasInstruments; Type: StepDownConverter; RoHS: True; Minimum Operating Temperature: -40C